# EasyEDA Pro project PID调试器（第二版）.eprj, schematic Schematic1
Board Name: Board1; Create Date: 2025-07-22; Page Name: P1; Project Name: PID调试器（第二版）; Schematic Name: Schematic1; Update Date: 2025-08-16; Company: 嘉立创EDA; Page Size: A4; Version: V1.0
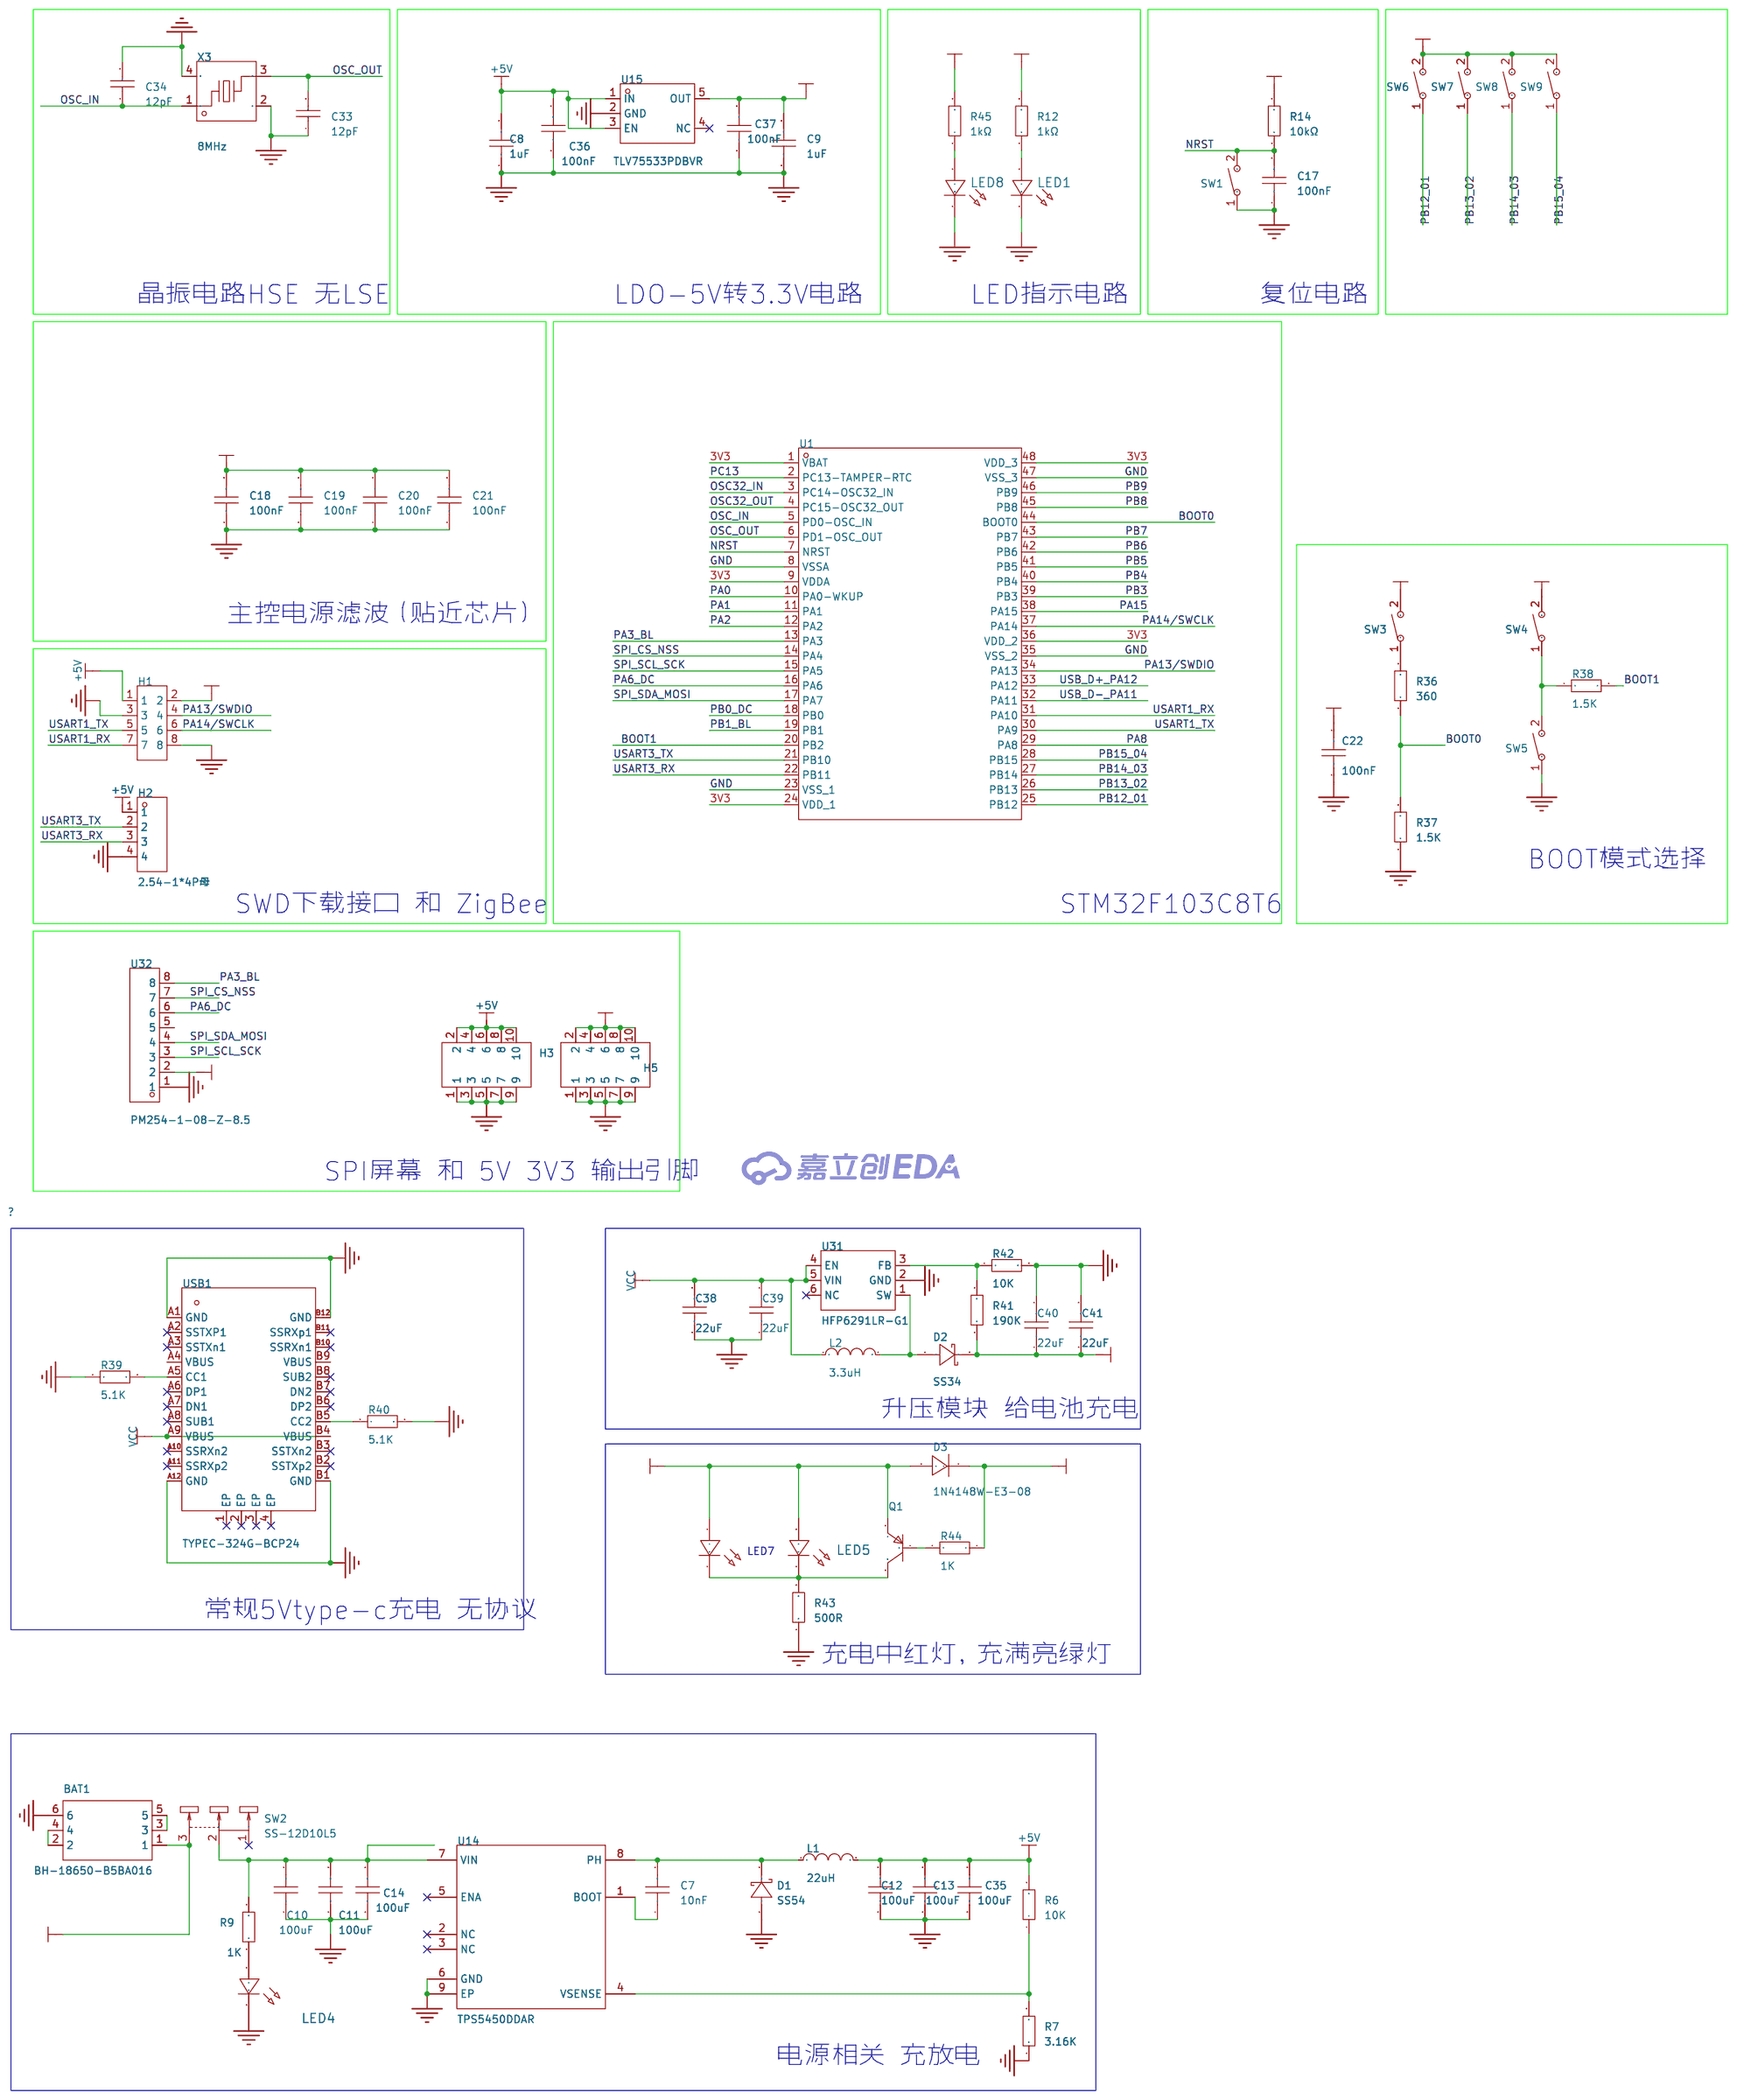
[diagram p0: schematic sheet]

## Parts
BAT1  BH-18650-B5BA016  [BAT-SMD_BH-18650-B5BA016]
C7  100nF  [C0603]
C8  100nF  [C0603]
C9  100nF  [C0603]
C10  100uF  [C1206]
C11  100uF  [C1206]
C12  100uF  [C1206]
C13  100uF  [C1206]
C14  100uF  [C1206]
C17  100nF  [R0603]
C18  100nF  [R0603]
C19  100nF  [R0603]
C20  100nF  [R0603]
C21  100nF  [R0603]
C22  100nF  [R0603]
C33  12pF  [R0603]
C34  12pF  [R0603]
C35  100uF  [C1206]
C36  100nF  [R0603]
C37  100nF  [R0603]
C38  22uF  [C0603]
C39  22uF  [C0603]
C40  22uF  [C0603]
C41  22uF  [C0603]
D1  SS54  [SMA_L4.3-W2.6-LS5.0-FD]
D2  SS34  [SMA_L4.3-W2.6-LS5.0-FD]
D3  1N4148W-E3-08  [SOD-123_L2.8-W1.8-LS3.7-RD]
H1  HX PZ2.54-4x2P ZZ  [HDR-TH_8P-P2.54-V-M-R2-C4-S2.54]
H2  2.54-1*4P母  [HDR-TH_4P-P2.54-V-F]
H3  PZ254V-12-10P  [HDR-TH_10P-P2.54-V-M-R2-C5-S2.54]
H5  PZ254V-12-10P  [HDR-TH_10P-P2.54-V-M-R2-C5-S2.54]
L1  22uH  [IND-SMD_L7.1-W6.6]
L2  3.3uH  [IND-SMD_L4.4-W4.2-A]
LED1  LTST-C190KSKT  [LED0603-RD]
LED4  -  [LED_0603]
LED5  -  [LED_0603]
LED7  -  [LED_0603]
LED8  LTST-C190KSKT  [LED0603-RD]
Q1  -  [S8550P_SOT]
R6  10K  [R0603]
R7  10K  [R0603]
R9  1K  [R0603]
R12  1kΩ  [R0603]
R14  10kΩ  [R0603]
R36  360  [R0603]
R37  1.5K  [R0603]
R38  1.5K  [R0603]
R39  5.1K  [R0603]
R40  5.1K  [R0603]
R41  190K  [R0603]
R42  10K  [R0603]
R43  500R  [R0603]
R44  1K  [R0603]
R45  1kΩ  [R0603]
SW1  TS-1101-B-W  [KEY-SMD_2P-L6.0-W3.6-P7.4-LS8.0-L]
SW2  SS-12D10L5  [SW-TH_SS-12D10L5]
SW3  TS-1101-B-W  [KEY-SMD_2P-L6.0-W3.6-P7.4-LS8.0-L]
SW4  TS-1101-B-W  [KEY-SMD_2P-L6.0-W3.6-P7.4-LS8.0-L]
SW5  TS-1101-B-W  [KEY-SMD_2P-L6.0-W3.6-P7.4-LS8.0-L]
SW6  TS-1101-B-W  [KEY-SMD_2P-L6.0-W3.6-P7.4-LS8.0-L]
SW7  TS-1101-B-W  [KEY-SMD_2P-L6.0-W3.6-P7.4-LS8.0-L]
SW8  TS-1101-B-W  [KEY-SMD_2P-L6.0-W3.6-P7.4-LS8.0-L]
SW9  TS-1101-B-W  [KEY-SMD_2P-L6.0-W3.6-P7.4-LS8.0-L]
U1  STM32F103C8T6  [LQFP-48_L7.0-W7.0-P0.50-LS9.0-BL]
U14  TPS5450DDAR  [SOP-8_L4.9-W3.9-P1.27-LS6.0-BL-EP]
U15  TLV75533PDBVR  [SOT-23-5_L3.0-W1.7-P0.95-LS2.8-BR]
U31  HFP6291LR-G1  [SOT-23-6_L2.9-W1.6-P0.95-LS2.8-BR]
U32  PM254-1-08-Z-8.5  [HDR-TH_8P-P2.54-V-F]
USB1  TYPEC-324G-BCP24  [USB-C-SMD_TYPEC-324G-BCP24]
X3  8MHz  [CRYSTAL-SMD_4P-L3.2-W2.5-BL-1]

## Library data of the parts
BAT1 = BH-18650-B5BA016: LCSC Part Name: 电池盒; Supplier Part: C19184086; Manufacturer: MYOUNG(美阳); Supplier Footprint: SMD; JLCPCB Part Class: 扩展库; Datasheet: https://atta.szlcsc.com/upload/public/pdf/source/20231108/D1617EC59CD55304B33DC60D90FEF183.pdf; Supplier: LCSC; Connector Type: 电池盒; Contact Plating: 金; Operating Temperature Range: -25℃~+85℃
C7-C9 C38-C41 = CAP_0603: Supplier Footprint: 0603
C10-C14 C35 = HGC1206R5107M100NSPJ: 容值:100uF;精度:±20%;额定电压:10V;材质(温度系数):X5R;; LCSC Part Name: 100uF ±20% 10V; Supplier Part: C7432784; Manufacturer: Chinocera(华瓷); Supplier Footprint: 1206; JLCPCB Part Class: 扩展库; Datasheet: https://atta.szlcsc.com/upload/public/pdf/source/20240320/FAC3FEC40A78BC5CCCE96C232A94D860.pdf; Supplier: LCSC; Tolerance: ±20%; Voltage Rated: 10V; Temperature Coefficient: X5R
C17-C22 C36 C37 = GRM155R71H104KE14D: 容值:100nF;精度:±10%;额定电压:50V;材质(温度系数):X7R;; LCSC Part Name: 100nF ±10% 50V; Supplier Part: C77020; Manufacturer: muRata(村田); Supplier Footprint: 0402; JLCPCB Part Class: 扩展库; Datasheet: https://atta.szlcsc.com/upload/public/pdf/source/20180326/C77020_39BD49C951FF1AF0DB1F1FAC5AC1E401.pdf; Supplier: LCSC; Tolerance: ±10%; Voltage Rated: 50V; Temperature Coefficient: X7R
C33 C34 = 0402CG120J500NT: 容值:12pF;精度:±5%;额定电压:50V;材质(温度系数):C0G;; LCSC Part Name: 12pF ±5% 50V; Supplier Part: C1547; Manufacturer: FH(风华); Supplier Footprint: 0402; JLCPCB Part Class: 基础库; Datasheet: https://atta.szlcsc.com/upload/public/pdf/source/20200305/C486355_26A10D38EF8C2A5C37091D0039909270.pdf; Supplier: LCSC; Tolerance: ±5%; Voltage Rated: 50V; Temperature Coefficient: C0G
D1 = SS54_C7420369: 二极管配置:独立式;正向压降(Vf):550mV@5.0A;直流反向耐压(Vr):40V;整流电流:5A;; LCSC Part Name: 电压:40V 电流:5A; Supplier Part: C7420369; Manufacturer: 宏迦橙; Supplier Footprint: SMA(DO-214AC); Datasheet: https://atta.szlcsc.com/upload/public/pdf/source/20230828/254C3882F8647358AD9F60DD73611B5E.pdf; Supplier: LCSC; Diode Configuration: 独立式; Forward Voltage (Vf@If): 550mV@5.0A; Reverse Voltage (Vr): 40V; Rectified Current: 5A; Reverse Leakage Current (Ir): 50uA@40V
D2 = SS34_C7420365: LCSC Part Name: 电压:40V 电流:3A; Supplier Part: C7420365; Manufacturer: 宏嘉诚; Supplier Footprint: SMA(DO-214AC); JLCPCB Part Class: 扩展库; Datasheet: https://item.szlcsc.com/datasheet/SS34/8397187.html; Supplier: LCSC; Diode Configuration: 独立式; Voltage - Forward(Vf@If): 550mV@3.0A; Voltage - DC Reverse(Vr): 40V; Current - Rectified: 3A; Reverse Leakage Current (Ir): 200uA@40V
D3 = 1N4148W-E3-08: Supplier Part: C241939; Manufacturer: VISHAY(威世); Supplier Footprint: SOD-123; Datasheet: https://item.szlcsc.com/datasheet/1N4148W-E3-08/240783.html; Supplier: LCSC; Diode Configuration: 1个独立式; Voltage - Forward(Vf@If): 1.2V@100mA; Voltage - DC Reverse(Vr): 75V; Current - Rectified: 150mA; Pd - Power Dissipation: 350mW; Reverse Leakage Current (Ir): 100uA@100V; Reverse Recovery Time (trr): 4ns; Non-Repetitive Peak Forward Surge Current: 2A
H1 = HX PZ2.54-4x2P ZZ: LCSC Part Name: 4x2P 间距:2.54mm 方针 直插; Supplier Part: C32713296; Manufacturer: hanxia(韩下); Supplier Footprint: 插件,P=2.54mm; JLCPCB Part Class: 扩展库; Datasheet: https://atta.szlcsc.com/upload/public/pdf/source/20240723/0F23DD8D77880DC95952980E48B1CF7C.pdf; Supplier: LCSC; Pin Structure: 4x2P; Pitch: 2.54mm; Row Spacing: 2.54mm; Circluar Pins/Square Pins: 方针; Mounting Type: 直插; Number of Rows: 四排; Number of Pins: 8P; Current Rating: 3A; Length of Mating Pin: 6mm; Insulation Height: 2.5mm; Length of End Connection Pin: 3mm; Contact Material: 黄铜; Contact Plating: 金; Operating Temperature: -40℃~+105℃; Color: 黑色
H2 = 2.54-1*4P母: LCSC Part Name: 间距:2.54mm 1x4P 直插; Supplier Part: C2718488; Manufacturer: BOOMELE(博穆精密); Supplier Footprint: 插件,P=2.54mm; JLCPCB Part Class: 扩展库; Datasheet: https://atta.szlcsc.com/upload/public/pdf/source/20210301/C2718488_F4427B881E42CAA8DDB0B1C12B3A522C.pdf; Supplier: LCSC; Holes Structure: 1x4P; Pitch: 2.54mm; Circular Hole / Square Hole: 方孔; Mounting Type: 直插; Number of Rows: 单排; Number of Holes: 4P; Current Rating (Max): 3A; Holes Direction: 顶部; Contact Material: 青铜; Operating Temperature Range: -40℃~+105℃
H3 H5 = PZ254V-12-10P: LCSC Part Name: 2x5P 间距:2.54mm 方针 直插; Supplier Part: C492422; Manufacturer: XFCN(兴飞); Supplier Footprint: 插件,P=2.54mm; JLCPCB Part Class: 扩展库; Datasheet: https://atta.szlcsc.com/upload/public/pdf/source/20200309/C492422_5020CEA01BE7051F9EA9DD81AB0A25E3.pdf; Supplier: LCSC; Pin Structure: 2x5P; Pitch: 2.54mm; Row Spacing: 2.54mm; Circluar Pins/Square Pins: 方针; Mounting Type: 直插; Number of Rows: 双排; Number of Pins: 10P; Length of Mating Pin: 6mm; Insulation Height: 2.5mm; Length of End Connection Pin: 3mm; Contact Material: 黄铜; Operating Temperature: -40℃~+105℃; Color: 黑色
L1 = YSPI0630A-220M: 电感值:22uH;精度:±20%;额定电流:3A;; LCSC Part Name: 22uH ±20%; Supplier Part: C497873; Manufacturer: YJYCOIN(益嘉源); Supplier Footprint: SMD,6.6x7.1mm; JLCPCB Part Class: 扩展库; Datasheet: https://atta.szlcsc.com/upload/public/pdf/source/20200317/C497869_D09F597887D5FB8B541C5C98B400E286.pdf; Supplier: LCSC; Tolerance: ±20%; Rated Current: 3A; DC Resistance (DCR): 130mΩ
L2 = FXL0420-3R3-M: LCSC Part Name: 3.3uH ±20% 4A; Supplier Part: C167207; Manufacturer: cjiang(长江微电); Supplier Footprint: SMD,4.2x4.4mm; JLCPCB Part Class: 扩展库; Datasheet: https://atta.szlcsc.com/upload/public/pdf/source/20240426/3189EA8206330E2108542F9E34E540E7.pdf; Supplier: LCSC; Tolerance: ±20%; Rated Current: 3.3A; Saturation Current (Isat): 4A; DC Resistance (DCR): 87mΩ; Type: 一体成型电感
LED1 LED8 = LTST-C190KSKT: LCSC Part Name: 黄灯; Supplier Part: C125095; Manufacturer: LITEON(光宝); Supplier Footprint: 0603; JLCPCB Part Class: Extended Part; Datasheet: https://atta.szlcsc.com/upload/public/pdf/source/20180129/C125095_15171881843821315881.pdf; Supplier: LCSC; Emitted Color: 黄色; Forward Voltage (VF): 2.1V; Power Dissipation: 75mW; Forward Current: 20mA; Dominant Wavelength: 584.5nm~597nm; Peak Wavelength: 588nm; Lens Color: 无色透明透镜; Luminous Intensity: 104mcd; Viewing Angle: 130°; Operating Temperature: -30℃~+85℃
LED4 LED5 = LED_0603-R: Supplier Footprint: 0603
LED7 = LED_0603-G: Supplier Footprint: 0603
Q1 = S8550_SOT_PNP: Supplier Footprint: SOT-23
R6 R7 R9 R36-R44 = Res_0603: Supplier Footprint: 0603
R12 R45 = 0402WGF1001TCE: 电阻类型:厚膜电阻;阻值:1kΩ;精度:±1%;功率:62.5mW;最大工作电压:50V;温度系数:±100ppm/℃;; LCSC Part Name: 1kΩ ±1% 62.5mW 厚膜电阻; Supplier Part: C11702; Manufacturer: UNI-ROYAL(厚声); Supplier Footprint: 0402; JLCPCB Part Class: 基础库; Datasheet: https://atta.szlcsc.com/upload/public/pdf/source/20200306/C422600_1E6D84923E4A46A82E41ADD87F860B5C.pdf; Supplier: LCSC; Type: 厚膜电阻; Tolerance: ±1%; Power(Watts): 62.5mW; Overload Voltage (Max): 50V; Temperature Coefficient: ±100ppm/℃; Operating Temperature Range: -55℃~+155℃
R14 = RC0402FR-0710KL: 电阻类型:厚膜电阻;阻值:10kΩ;精度:±1%;功率:62.5mW;最大工作电压:50V;温度系数:±100ppm/℃;; LCSC Part Name: 厚膜电阻 10kΩ ±1% 62.5mW; Supplier Part: C60490; Manufacturer: YAGEO(国巨); Supplier Footprint: 0402; JLCPCB Part Class: 扩展库; Datasheet: https://atta.szlcsc.com/upload/public/pdf/source/20170925/C131467_1506321478108990263.pdf; Supplier: LCSC; Type: 厚膜电阻; Tolerance: ±1%; Power(Watts): 62.5mW; Overload Voltage (Max): 50V; Temperature Coefficient: ±100ppm/℃; Operating Temperature Range: -55℃~+155℃
SW1 SW3-SW9 = TS-1101-B-W_C500065: 触点电流:50mA;额定电压(DC):12V;绝缘电阻:-;电路结构:单刀单掷;安装方式:立贴;带灯:无;作用力:160gf;机械寿命:5万次;带支架:否;; LCSC Part Name: 6*3.6*2.5mm 立贴 轻触开关; Supplier Part: C500065; Manufacturer: XKB Connectivity(中国星坤); Supplier Footprint: SMD; JLCPCB Part Class: 扩展库; Datasheet: https://atta.szlcsc.com/upload/public/pdf/source/20211011/D0E0CAF534F7B19DDE4CE68748A25BD3.pdf; Supplier: LCSC; Contact Current: 50mA; Voltage Rating (DC): 12V; Circuit: 单刀单掷; Mounting Style: 立贴; Actuator Style: 矩形按钮; Actuator/Cap Color: 白色; With Lamp: 无; Operating Force: 160gf; Mechanical Life: 5万次; Operating Temperature: -30℃~+85℃; Switch Length: 6mm; Switch Width: 3.6mm; Switch Height: 2.5mm; Strike Gundam: 否
SW2 = SS-12D10L5: 电路结构:单刀双掷;安装方式:直插;开关颜色:黑色;额定电流(DC):3A;额定电压(DC):125V;额定电流(AC):3A;额定电压(AC):125V;机械寿命:1万次;; LCSC Part Name: 柄长5mm 直插双档 滑动开关; Supplier Part: C319012; Manufacturer: XKB Connectivity(中国星坤); Supplier Footprint: 插件; Datasheet: https://atta.szlcsc.com/upload/public/pdf/source/20211009/D6412F37AABE6F9459A6EE7FA4DAEADB.pdf; Supplier: LCSC; Circuit: 单刀双掷; Actuator Style: 矩形柱状; Pin Style: PC引脚; Switch Length: 13mm; Switch Width: 6.8mm; Switch Height: 6.4mm; Mounting Style: 直插; Actuator Color: 黑色; Current Rating (DC): 3A; Voltage Rating (DC): 125V; Current Rating (AC): 3A; Voltage Rating (AC): 125V; Mechanical Life: 1万次; Operating Temperature: -40℃~+85℃
U1 = STM32F103C8T6: CPU内核:CM3;程序存储容量:64KB;RAM总容量:20KB;GPIO端口数量:37;工作电压范围:2V~3.6V;CPU最大主频:72MHz;程序存储器类型:FLASH;; LCSC Part Name: STM32F103C8T6 MSL=3; Supplier Part: C8734; Manufacturer: ST(意法半导体); Supplier Footprint: LQFP-48(7x7); JLCPCB Part Class: 扩展库; Datasheet: https://atta.szlcsc.com/upload/public/pdf/source/20220812/8363ACEC51AD55ECEB84799464F7CB85.pdf; Supplier: LCSC; CPU Core: CM3; Program Storage Size: 64KB; RAM Size: 20KB; GPIO Ports Number: 37; Operating Voltage Range: 2V~3.6V; CPU Maximum Speed: 72MHz; Program Memory Type: FLASH; Operating Temperature Range: -40℃~+85℃; ADC (Bit): 12bit; Universal Serial Bus: 有; Peripheral/Function: 看门狗；DMA；看门狗；片载温度传感器; Watchdog: 有; Infrared Data Association: 有; Low-Voltage Detect: 有; Direct Memory Access: 有; Internal Oscillator: 有
U14 = TPS5450DDAR: 功能类型:降压型;输出类型:可调;工作电压:5.5V~36V;输出电压:1.221V~31.32V;输出电流:5A;; LCSC Part Name: 5A宽输入范围降压转换器; Supplier Part: C114425; Manufacturer: TI(德州仪器); Supplier Footprint: SOP-8-EP-150mil; JLCPCB Part Class: 扩展库; Datasheet: https://www.ti.com/cn/lit/gpn/tps5450; Supplier: LCSC; Function: 降压型; Output Type: 可调; Input Voltage: 5.5V~36V; Output Voltage: 1.221V~31.32V; Output Current: 5A; Switching Frequency: 500kHz; Operating Temperature: -40℃~+125℃@(TJ); Synchronous Rectification: 否; Number of Outputs: 1; Topology: 降压式; Switch tube (built-in/external): 内置
U15 = TLV75533PDBVR: 输出类型:固定;最大输入电压:5.5V;输出电压:3.3V;输出电流:500mA;电源纹波抑制比(PSRR):52dB;输出极性:正极;; LCSC Part Name: 具有使能功能的 500mA、高 PSRR、低 IQ、低压降稳压器; Supplier Part: C404027; Manufacturer: TI(德州仪器); Supplier Footprint: SOT-23-5; JLCPCB Part Class: 扩展库; Datasheet: https://www.ti.com/cn/lit/gpn/tlv755p; Supplier: LCSC; Output Type: 固定; Maximum Input Voltage: 5.5V; Output Voltage: 3.3V; Output Current: 500mA; Power Supply Rejection Ratio (PSRR): 52dB; Dropout Voltage: 238mV@(500mA); standby current: 31uA; Feature: 防静电保护；浪涌保护；低ESR；热保护(TSD)；欠压闭锁；过流保护(OCP)；带使能; Operating Temperature: -40℃~+125℃@(Tj); Output Polarity: 正极; Number of Outputs: 1
U31 = HFP6291LR-G1: LCSC Part Name: 微小型高效率升压型DC/DC调整器; Supplier Part: C22396393; Manufacturer: HXY MOSFET(华轩阳电子); Supplier Footprint: SOT-23-6L; JLCPCB Part Class: 扩展库; Datasheet: https://atta.szlcsc.com/upload/public/pdf/source/20240509/A9FF322FD4EEEBF153044EDD76C1B9E3.pdf; Supplier: LCSC; Function: 升压型; Voltage - Supply: 2V~24V; Frequency - Switching: 1.2MHz; Operating Temperature: -40℃~+80℃; Number of Outputs: 1; Topology: 升压式; Switch tube (built-in/external): 内置
U32 = PM254-1-08-Z-8.5: LCSC Part Name: 1x8P 间距:2.54mm 直插; Supplier Part: C2897371; Manufacturer: HCTL(华灿天禄); Supplier Footprint: 插件,P=2.54mm; JLCPCB Part Class: 扩展库; Datasheet: https://atta.szlcsc.com/upload/public/pdf/source/20230609/534BE42964C679BDE98E061007C4ABD6.pdf; Supplier: LCSC; Holes Structure: 1x8P; Pitch: 2.54mm; Circular Hole / Square Hole: 方孔; Mounting Type: 直插; Number of Rows: 单排; Number of Holes: 8P; Current Rating (Max): 3A; Holes Direction: 顶部; Insulation Height: 8.5mm; Contact Material: 铜合金; Operating Temperature Range: -40℃~+105℃; Soldering Temperature(Max): 260℃@5S
USB1 = TYPEC-324G-BCP24: LCSC Part Name: Type-C 母 卧贴; Supplier Part: C920230; Manufacturer: XUNPU(讯普); Supplier Footprint: SMD; JLCPCB Part Class: 扩展库; Datasheet: https://atta.szlcsc.com/upload/public/pdf/source/20240730/570E6E6917F128F926C9CCEF1574B0B5.pdf; Supplier: LCSC; Connector Type: Type-C; Standard: USB 3.1; Gender: 母; Mounting Style: 卧贴; Number of Contacts: 24P; Number of Ports: 1; Current Rating - Power (Max): 5A; Operating Temperature Range: -45℃~+85℃
X3 = XL2EL89COI-111YLC-8M: 晶振类型:贴片晶振;频率:8MHz;常温频差:±10ppm;外接负载电容:12pF;频率稳定度(全温):±20ppm;; LCSC Part Name: 8MHz ±10ppm 12pF; Supplier Part: C2973805; Manufacturer: YXC(扬兴晶振); Supplier Footprint: SMD3225-4P; JLCPCB Part Class: 扩展库; Datasheet: https://atta.szlcsc.com/upload/public/pdf/source/20240329/19D5F850207469550BEB00D7DFEDBC7A.pdf; Supplier: LCSC; Crystal Type: 贴片晶振; Normal temperature Frequency Tolerance: ±10ppm; External load capacitor: 12pF; Frequency Stability(Full temperature range): ±20ppm; Equivalent Series Resistance (ESR): 150Ω; Operating Temperature: -40℃~+85℃

## Nets
3V3: C9.2 C18.2 C19.2 C20.2 C21.2 C22.2 C37.2 H1.2 H5.2 H5.4 H5.6 H5.8 H5.10 R12.2 R14.2 SW3.2 SW4.2 SW6.2 SW7.2 SW8.2 SW9.2 U1.1(VBAT) U1.9(VDDA) U1.24(VDD_1) U1.36(VDD_2) U1.48(VDD_3) U15.5(OUT) U32.2
+5V: C8.2 C12.2 C13.2 C35.2 C36.2 H1.1 H2.1 H3.2 H3.4 H3.6 H3.8 H3.10 L1.2 R6.2 R45.2 U15.1(IN) U15.3(EN)
+12V: C40.1 C41.1 D2.2(K) D3.2(A) LED5.2(A) LED7.2(A) Q1.2(E) R41.1
GND: BAT1.6 C8.1 C9.1 C10.1 C11.1 C12.1 C13.1 C14.1 C17.1 C18.1 C19.1 C20.1 C21.1 C22.1 C33.1 C34.2 C35.1 C36.1 C37.1 C38.1 C39.1 C40.2 C41.2 D1.1(A) H1.3 H1.8 H2.4 H3.1 H3.3 H3.5 H3.7 H3.9 H5.1 H5.3 H5.5 H5.7 H5.9 LED1.1(C) LED4.1(C) LED8.1(C) R7.1 R37.1 R39.1 R40.2 R42.2 R43.1 SW1.1 SW5.1 U1.8(VSSA) U1.23(VSS_1) U1.35(VSS_2) U1.47(VSS_3) U14.6(GND) U14.9(EP) U15.2(GND) U31.2(GND) U32.1 USB1.A1(GND) USB1.A12(GND) USB1.B1(GND) USB1.B12(GND) X3.2(GND) X3.4(GND)
VCC: C38.2 C39.2 L2.1 U31.4(EN) U31.5(VIN) USB1.A9(VBUS) USB1.B4(VBUS)
VIN: BAT1.1 D3.1(K) R44.1 SW2.3
BOOT0: R36.1 R37.2 U1.44(BOOT0)
BOOT1: R38.2 U1.20(PB2)
NRST: C17.2 R14.1 SW1.2 U1.7(NRST)
OSC32_IN: U1.3(PC14-OSC32_IN)
OSC32_OUT: U1.4(PC15-OSC32_OUT)
OSC_IN: C34.1 U1.5(PD0-OSC_IN) X3.1
OSC_OUT: C33.2 U1.6(PD1-OSC_OUT) X3.3
PA0: U1.10(PA0-WKUP)
PA1: U1.11(PA1)
PA2: U1.12(PA2)
PA3_BL: U1.13(PA3) U32.8
PA6_DC: U1.16(PA6) U32.6
PA8: U1.29(PA8)
PA13/SWDIO: H1.4 U1.34(PA13)
PA14/SWCLK: H1.6 U1.37(PA14)
PA15: U1.38(PA15)
PB0_DC: U1.18(PB0)
PB1_BL: U1.19(PB1)
PB3: U1.39(PB3)
PB4: U1.40(PB4)
PB5: U1.41(PB5)
PB6: U1.42(PB6)
PB7: U1.43(PB7)
PB8: U1.45(PB8)
PB9: U1.46(PB9)
PB12_01: SW6.1 U1.25(PB12)
PB13_02: SW7.1 U1.26(PB13)
PB14_03: SW8.1 U1.27(PB14)
PB15_04: SW9.1 U1.28(PB15)
PC13: U1.2(PC13-TAMPER-RTC)
SPI_CS_NSS: U1.14(PA4) U32.7
SPI_SCL_SCK: U1.15(PA5) U32.3
SPI_SDA_MOSI: U1.17(PA7) U32.4
USART1_RX: H1.7 U1.31(PA10)
USART1_TX: H1.5 U1.30(PA9)
USART3_RX: H2.3 U1.22(PB11)
USART3_TX: H2.2 U1.21(PB10)
USB_D+_PA12: U1.33(PA12)
USB_D-_PA11: U1.32(PA11)
$1N1992: LED1.2(A) R12.1
$1N4251: C10.2 C11.2 C14.2 R9.2 SW2.2 U14.7(VIN)
$1N4254: C7.2 D1.2(K) L1.1 U14.8(PH)
$1N4256: C7.1 U14.1(BOOT)
$1N4260: R6.1 R7.2 U14.4(VSENSE)
$1N4269: LED4.2(A) R9.1
$1N6190: BAT1.2 BAT1.4
$1N6207: BAT1.3 BAT1.5
$1N14427: R39.2 USB1.A5(CC1)
$1N14460: R40.1 USB1.B5(CC2)
$1N14741: D2.1(A) L2.2 U31.1(SW)
$1N14892: R41.2 R42.1 U31.3(FB)
$1N19318: LED5.1(C) LED7.1(C) Q1.3(C) R43.2
$1N19371: Q1.1(B) R44.2
$1N31426: LED8.2(A) R45.1
Net-(R36-2): R36.2 SW3.1
Net-(R38-1): R38.1 SW4.1 SW5.2

Not connected (* = marked no-connect by the designer): SW2 1*; U14 2(NC)* 3(NC)* 5(ENA)*; U15 4(NC)*; U31 6(NC)*; U32 5; USB1 1(EP)* 2(EP)* 3(EP)* 4(EP)* A2(SSTXP1)* A3(SSTXn1)* A4(VBUS) A6(DP1)* A7(DN1)* A8(SUB1)* A10(SSRXn2)* A11(SSRXp2)* B2(SSTXp2)* B3(SSTXn2)* B6(DP2)* B7(DN2)* B8(SUB2)* B9(VBUS) B10(SSRXn1)* B11(SSRXp1)*

## Notes on the sheet
- 晶振电路HSE 无LSE
- LDO-5V转3.3V电路
- LED指示电路
- 复位电路
- 主控电源滤波（贴近芯片）
- BOOT模式选择
- SWD下载接口 和 ZigBee
- STM32F103C8T6
- SPI屏幕 和 5V 3V3 输出引脚
- 升压模块 给电池充电
- 常规5Vtype-c充电 无协议
- 充电中红灯，充满亮绿灯
- 电源相关 充放电
